# EasyEDA Pro project 外接板20260402.eprj, schematic Schematic1

## Sheets
1 P1: Board Name: Board1; Create Date: 2026-01-12; Page Name: P1; Project Name: 外接板20260402; Schematic Name: Schematic1; Update Date: 2026-05-07; Company: 嘉立创EDA; Page Size: A4; Version: V1.0
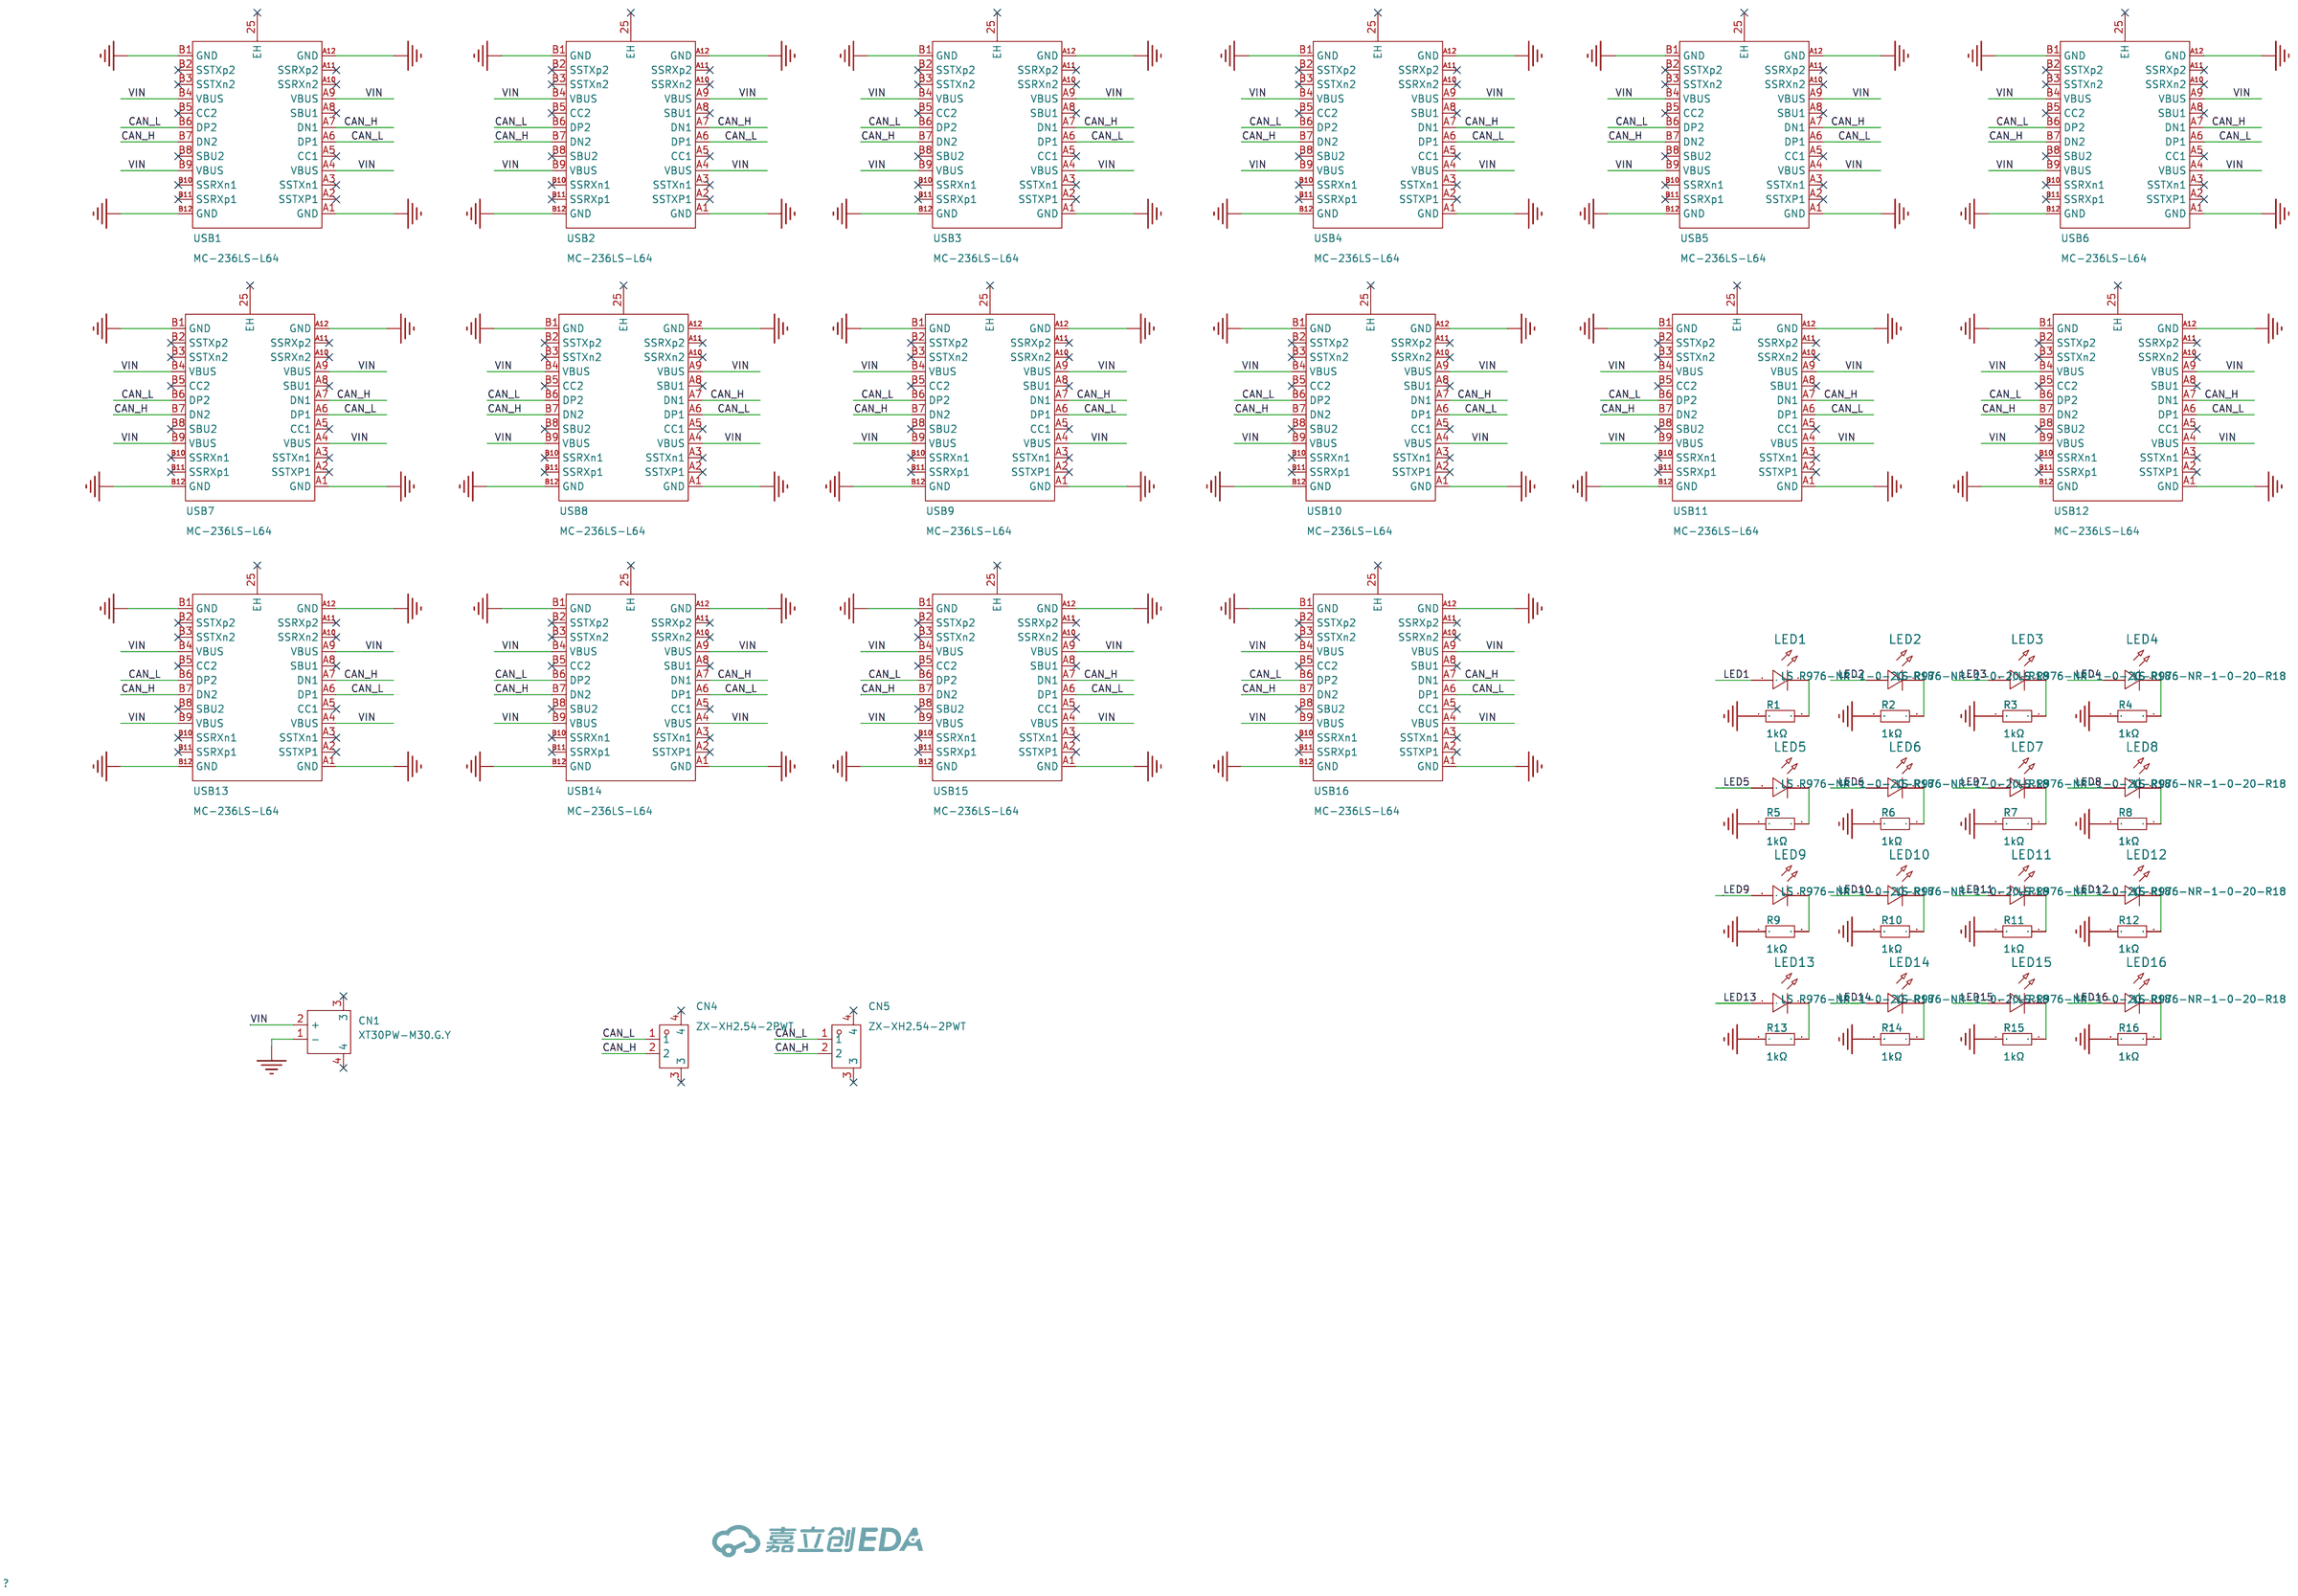
[diagram p0: P1]
2 P2: Create Date: 2026-04-22; Page Name: P2; Update Date: 2026-08-14
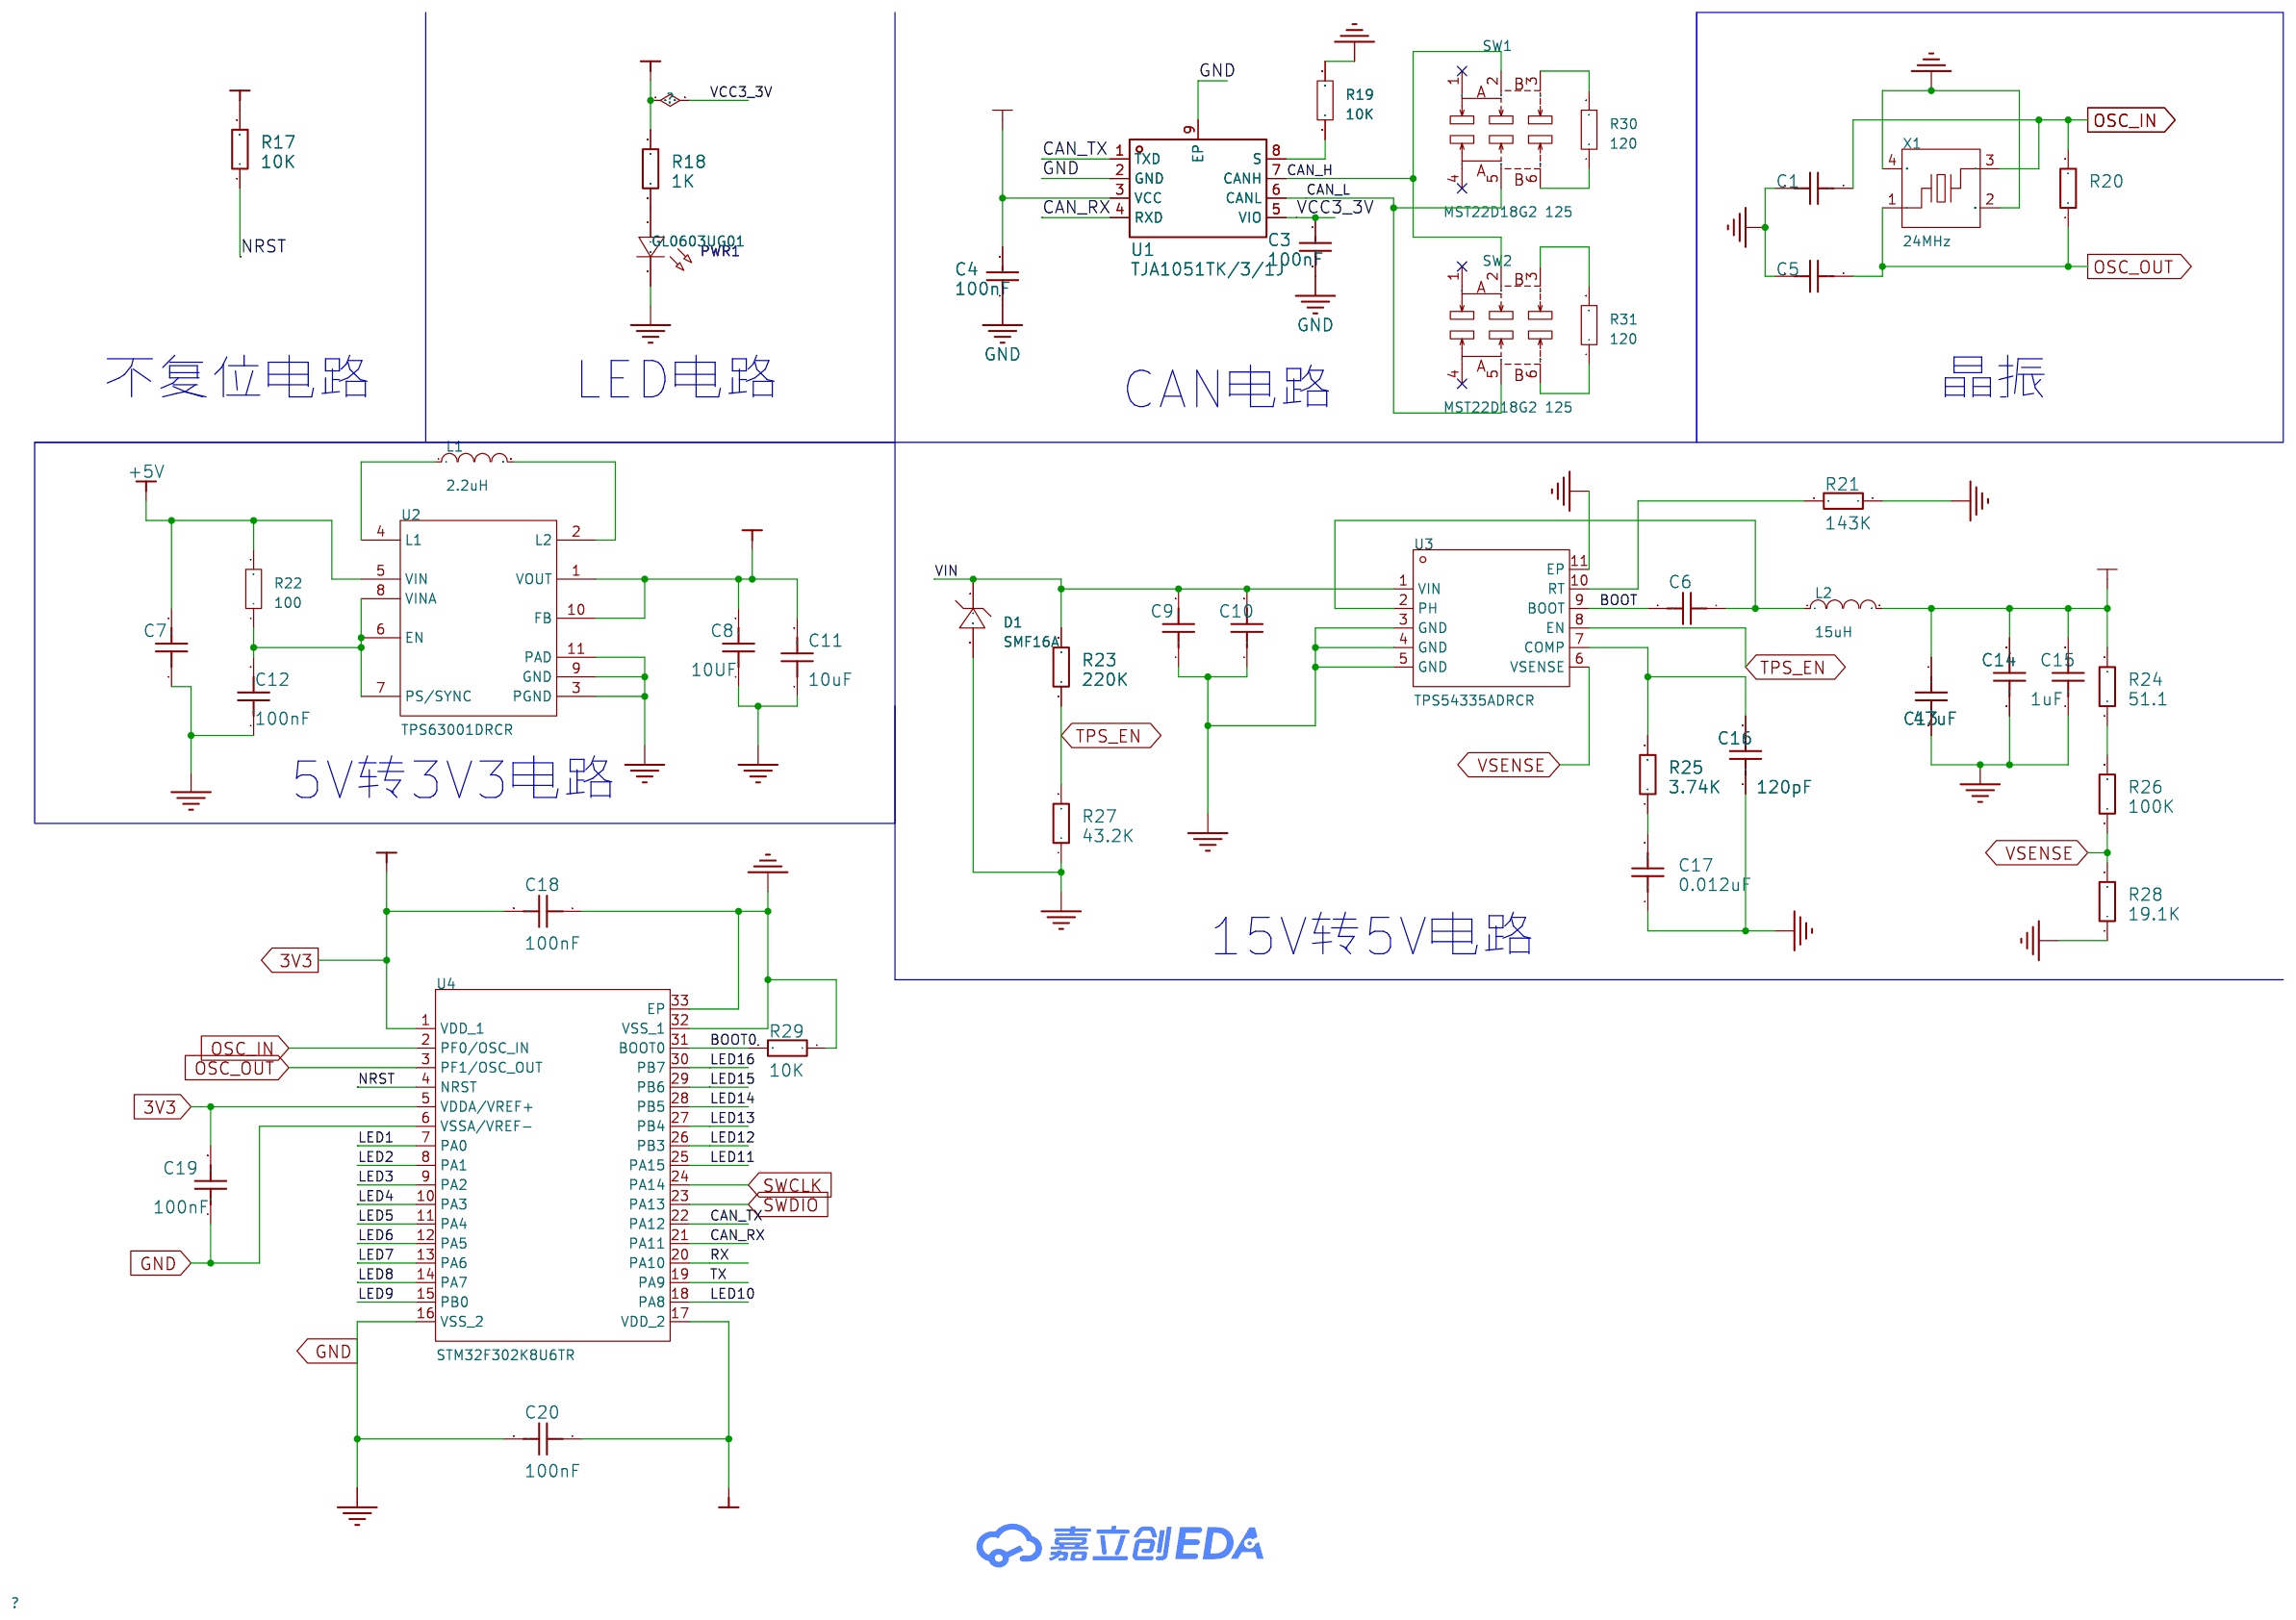
[diagram p1: P2]

## Parts
sheet P1
CN1  XT30PW-M30.G.Y  [CONN-TH_XT30PW-M]
CN4  ZX-XH2.54-2PWT  [CONN-SMD_2P-P2.54_MEGASTAR_ZX-XH2.54-2PWT]
CN5  ZX-XH2.54-2PWT  [CONN-SMD_2P-P2.54_MEGASTAR_ZX-XH2.54-2PWT]
LED1  LS R976-NR-1-0-20-R18  [LED0805-RD_RED]
LED2  LS R976-NR-1-0-20-R18  [LED0805-RD_RED]
LED3  LS R976-NR-1-0-20-R18  [LED0805-RD_RED]
LED4  LS R976-NR-1-0-20-R18  [LED0805-RD_RED]
LED5  LS R976-NR-1-0-20-R18  [LED0805-RD_RED]
LED6  LS R976-NR-1-0-20-R18  [LED0805-RD_RED]
LED7  LS R976-NR-1-0-20-R18  [LED0805-RD_RED]
LED8  LS R976-NR-1-0-20-R18  [LED0805-RD_RED]
LED9  LS R976-NR-1-0-20-R18  [LED0805-RD_RED]
LED10  LS R976-NR-1-0-20-R18  [LED0805-RD_RED]
LED11  LS R976-NR-1-0-20-R18  [LED0805-RD_RED]
LED12  LS R976-NR-1-0-20-R18  [LED0805-RD_RED]
LED13  LS R976-NR-1-0-20-R18  [LED0805-RD_RED]
LED14  LS R976-NR-1-0-20-R18  [LED0805-RD_RED]
LED15  LS R976-NR-1-0-20-R18  [LED0805-RD_RED]
LED16  LS R976-NR-1-0-20-R18  [LED0805-RD_RED]
R1  1kΩ  [R0805]
R2  1kΩ  [R0805]
R3  1kΩ  [R0805]
R4  1kΩ  [R0805]
R5  1kΩ  [R0805]
R6  1kΩ  [R0805]
R7  1kΩ  [R0805]
R8  1kΩ  [R0805]
R9  1kΩ  [R0805]
R10  1kΩ  [R0805]
R11  1kΩ  [R0805]
R12  1kΩ  [R0805]
R13  1kΩ  [R0805]
R14  1kΩ  [R0805]
R15  1kΩ  [R0805]
R16  1kΩ  [R0805]
USB1  MC-236LS-L64  [TYPE-C-USB-SMD_TYPE-C-31-M-06]
USB2  MC-236LS-L64  [TYPE-C-USB-SMD_TYPE-C-31-M-06]
USB3  MC-236LS-L64  [TYPE-C-USB-SMD_TYPE-C-31-M-06]
USB4  MC-236LS-L64  [TYPE-C-USB-SMD_TYPE-C-31-M-06]
USB5  MC-236LS-L64  [TYPE-C-USB-SMD_TYPE-C-31-M-06]
USB6  MC-236LS-L64  [TYPE-C-USB-SMD_TYPE-C-31-M-06]
USB7  MC-236LS-L64  [TYPE-C-USB-SMD_TYPE-C-31-M-06]
USB8  MC-236LS-L64  [TYPE-C-USB-SMD_TYPE-C-31-M-06]
USB9  MC-236LS-L64  [TYPE-C-USB-SMD_TYPE-C-31-M-06]
USB10  MC-236LS-L64  [TYPE-C-USB-SMD_TYPE-C-31-M-06]
USB11  MC-236LS-L64  [TYPE-C-USB-SMD_TYPE-C-31-M-06]
USB12  MC-236LS-L64  [TYPE-C-USB-SMD_TYPE-C-31-M-06]
USB13  MC-236LS-L64  [TYPE-C-USB-SMD_TYPE-C-31-M-06]
USB14  MC-236LS-L64  [TYPE-C-USB-SMD_TYPE-C-31-M-06]
USB15  MC-236LS-L64  [TYPE-C-USB-SMD_TYPE-C-31-M-06]
USB16  MC-236LS-L64  [TYPE-C-USB-SMD_TYPE-C-31-M-06]
sheet P2
C1  8pF  [C0603]
C3  100nF  [C0603]
C4  100nF  [C0603]
C5  8pF  [C0603]
C6  100nF  [C0603]
C7  10uF  [C0603]
C8  10UF  [C0603]
C9  10uF  [C0603]
C10  100nF  [C0603]
C11  10uF  [C0603]
C12  100nF  [C0603]
C13  47uF  [CASE-B_3528-A]
C14  47uF  [C0603]
C15  1uF  [C0603]
C16  120pF  [C0603]
C17  0.012uF  [C0603]
C18  100nF  [C0603]
C19  100nF  [C0603]
C20  100nF  [C0603]
D1  SMF16A  [SOD-123_L2.8-W1.8-LS3.7-RD]
L1  2.2uH  [IND-SMD_L4.0-W4.0_LQH44PN2R2MP0L]
L2  15uH  [IND-SMD_L7.3-W6.8]
PWR1  GL0603UG01  [LED0603-RD]
R17  10K  [R0603]
R18  1K  [R0603]
R19  10K  [R0805]
R20  1MΩ  [R0603]
R21  143K  [R0603]
R22  100  [R0603]
R23  220K  [R0603]
R24  51.1  [R0603]
R25  3.74K  [R0603]
R26  100K  [R0603]
R27  43.2K  [R0603]
R28  19.1K  [R0603]
R29  10K  [R0603]
R30  120  [R0603]
R31  120  [R0603]
SW1  MST22D18G2 125  [SW-SMD_MST22D18G2]
SW2  MST22D18G2 125  [SW-SMD_MST22D18G2]
U1  TJA1051TK/3/1J  [HVSON-8_L3.0-W3.0-P0.65-BL-EP]
U2  TPS63001DRCR  [VSON-10_L3.0-W3.0-P0.50-TL-EP_TPS62410DRCR]
U3  TPS54335ADRCR  [VSON-10_L3.0-W3.0-P0.50-TL-EP]
U4  STM32F302K8U6TR  [UFQFPN-32_L5.0-W5.0-P0.50-TL-EP3.5]
X1  24MHz  [CRYSTAL-SMD_4P-L2.0-W1.6-BL-A]

## Library data of the parts
CN1 = XT30PW-M30.G.Y: 类别:-;类型1:-;; LCSC Part Name: AMASS(艾迈斯)航模插头 卧式弯脚 XT30PW-M公头; Supplier Part: C431092; Manufacturer: AMASS(艾迈斯); JLCPCB Part Class: 扩展库; Datasheet: https://item.szlcsc.com/datasheet/XT30PW-M30.G.Y/426930.html; Supplier: LCSC; Type: 航模插头; RatedVoltage: DC 500V; InterfaceType: 公头; RatedCurrent: 15A; RecommendedWireGauge: 16/18/20AWG; contact resistance: 1.2mΩ; specifications: 2pin
CN4 CN5 = ZX-XH2.54-2PWT: LCSC Part Name: 1x2P 间距:2.5mm 卧贴 系列:XH; Supplier Part: C7429671; Manufacturer: Megastar(兆星); Supplier Footprint: SMD,P=2.5mm,卧贴; JLCPCB Part Class: 扩展库; Datasheet: https://item.szlcsc.com/datasheet/ZX-XH2.54-2PWT/8427588.html; Supplier: LCSC; Pins Structure: 1x2P; Pitch: 2.5mm; Mounting Type: 卧贴; Reference Series: XH; Number of Pins: 2P; Number of Rows: 1; Number of PINs Per Row: 2; Current Rating: 3A; Contact Material: 黄铜; Contact Plating: 锡; Operating Temperature: -25℃~+85℃; Voltage Rating: 250V; Plastic Material: LCP; Supplementary Features: 辅助焊脚; Color: 米色; Z-Height of the Board: 6.2mm; X-Length of Bottom Edge on Board (Spacing Line): 10mm; Y-Width of Bottom Edge on Board: 7.8mm
LED1-LED16 = LS R976-NR-1-0-20-R18: LCSC Part Name: 0805红(雾状); Supplier Part: C2899997; Manufacturer: OSRAM(欧司朗); Supplier Footprint: 0805; JLCPCB Part Class: Extended Part; Datasheet: https://item.szlcsc.com/datasheet/LS%2520R976-NR-1-0-20-R18/3147924.html; Supplier: LCSC; Illumination Color: 红色; Voltage - Forward(Vf): 2V; Forward Current: 20mA; Wavelength - Dominant: 625nm~650nm; Peak Wavelength: 645nm; Lens Color: 雾状白色透镜; Luminous Intensity: 180mcd; Viewing Angle: 160°; Operating Temperature: -30℃~+85℃
R1-R16 = 0805W8F1001T5E: LCSC Part Name: 1kΩ ±1% 125mW 厚膜电阻; Supplier Part: C17513; Manufacturer: UNI-ROYAL(厚声); Supplier Footprint: 0805; JLCPCB Part Class: Basic Part; Datasheet: https://atta.szlcsc.com/upload/public/pdf/source/20200306/C422600_1E6D84923E4A46A82E41ADD87F860B5C.pdf; Supplier: LCSC; Type: 厚膜电阻; Tolerance: ±1%; Power(Watts): 125mW; Overload Voltage (Max): 150V; Temperature Coefficient: ±100ppm/℃; Operating Temperature Range: -55℃~+155℃
USB1-USB16 = MC-236LS-L64: 连接器类型:Type-C;协议标准:USB 3.1;公母:母;安装方式:立贴;触点数量:24P;端口数量:1;额定电流 - 电源:5A;工作温度:-25℃~+85℃;; LCSC Part Name: Type-C 母 立贴; Supplier Part: C3039314; Manufacturer: HANBO(汉博); Supplier Footprint: SMD; JLCPCB Part Class: 扩展库; Datasheet: https://item.szlcsc.com/datasheet/MC-236LS-L64/3592990.html; Supplier: LCSC; Connector Type: Type-C; Protocol Standard: USB 3.1; Gender: 母; Mounting Type: 立贴; Number of Contacts: 24P; Number of Ports: 1; Current Rating-Power: 5A; Voltage Rating: 5V; Connect-Disconnect Life: 1万次; Operating Temperature: -25℃~+85℃
C1 C5 = GRM0335C1H8R0BA01D: LCSC Part Name: ±0.1pF 8pF 50V; Supplier Part: C237417; Manufacturer: muRata(村田); Supplier Footprint: 0201; JLCPCB Part Class: Extended Part; Datasheet: https://atta.szlcsc.com/upload/public/pdf/source/20190418/C237417_572FB960CC3E056ED40D37BCF7887CC2.pdf; Supplier: LCSC; Voltage Rating: 50V; Temperature Coefficient: C0G
C3 C4 C8 C11 C12 C15 C18 C20 = CL03A104KA3NNNC: LCSC Part Name: 100nF(104) ±10% 25V; Supplier Part: C307379; Manufacturer: SAMSUNG(三星); Supplier Footprint: 0201; JLCPCB Part Class: Extended Part; Datasheet: https://atta.szlcsc.com/upload/public/pdf/source/20181009/C307379_F5D0B236C3A55D5E06FA2567D45F0174.pdf; Supplier: LCSC; Temperature Coefficient: X5R; Voltage Rated: 25V; Tolerance: ±10%
C6 C10 = CGA0603X7R104K500JT: LCSC Part Name: 100nF ±10% 50V; Supplier Part: C6119867; Manufacturer: HRE(芯声); Supplier Footprint: 0603; JLCPCB Part Class: Extended Part; Datasheet: https://item.szlcsc.com/datasheet/CGA0603X7R104K500JT/7062573.html; Supplier: LCSC; Tolerance: ±10%; Voltage Rating: 50V; Temperature Coefficient: X7R
C7 = CGA0603X5R106K100JT: LCSC Part Name: 10uF ±10% 10V; Supplier Part: C6119842; Manufacturer: HRE(芯声); Supplier Footprint: 0603; JLCPCB Part Class: Extended Part; Datasheet: https://item.szlcsc.com/datasheet/CGA0603X5R106K100JT/7062548.html; Supplier: LCSC; Tolerance: ±10%; Voltage Rating: 10V; Temperature Coefficient: X5R
C9 = HGC0603R5106M350NTHJ: LCSC Part Name: 10uF ±20% 35V; Supplier Part: C22367827; Manufacturer: Chinocera(华瓷); Supplier Footprint: 0603; JLCPCB Part Class: Extended Part; Datasheet: https://item.szlcsc.com/datasheet/HGC0603R5106M350NTHJ/23841132.html; Supplier: LCSC; Tolerance: ±20%; Voltage Rating: 35V; Temperature Coefficient: X5R
C13 = TAJB476K010RNJ: LCSC Part Name: 47uF ±10% 10V; Supplier Part: C22036; Manufacturer: Kyocera AVX; Supplier Footprint: CASE-B-3528; JLCPCB Part Class: Extended Part; Datasheet: https://atta.szlcsc.com/upload/public/pdf/source/20160107/1457707750344.pdf; Supplier: LCSC; Tolerance: ±10%; Rated Voltage: 10V; Equivalent Series Resistance(ESR): 1Ω@100kHz; Operating Temperature: -55℃~+125℃
C14 = CGA0603X5R105K500JT: LCSC Part Name: 1uF ±10% 50V; Supplier Part: C6119852; Manufacturer: HRE(芯声); Supplier Footprint: 0603; JLCPCB Part Class: Extended Part; Datasheet: https://item.szlcsc.com/datasheet/CGA0603X5R105K500JT/7062558.html; Supplier: LCSC; Tolerance: ±10%; Voltage Rating: 50V; Temperature Coefficient: X5R
C16 = CAP_0603: Supplier Footprint: 0603
C17 = CGA0603X7R123K500JT: LCSC Part Name: 12nF ±10% 50V; Supplier Part: C36911408; Manufacturer: HRE(芯声); Supplier Footprint: 0603; JLCPCB Part Class: Extended Part; Datasheet: https://item.szlcsc.com/datasheet/CGA0603X7R123K500JT/38636296.html; Supplier: LCSC; Tolerance: ±10%; Voltage Rating: 50V; Temperature Coefficient: X7R
C19 = CL05B104KB54PNC: LCSC Part Name: 100nF ±10% 50V; Supplier Part: C307331; Manufacturer: SAMSUNG(三星); Supplier Footprint: 0402; JLCPCB Part Class: Basic Part; Datasheet: https://item.szlcsc.com/datasheet/CL05B104KB54PNC/291005.html; Supplier: LCSC; Tolerance: ±10%; Voltage Rating: 50V; Temperature Coefficient: X7R
D1 = SMF16A: Supplier Part: C266686; Manufacturer: FMS(美丽微); Supplier Footprint: SOD-123; JLCPCB Part Class: 扩展库; Datasheet: https://item.szlcsc.com/datasheet/SMF16A/256777.html; Supplier: LCSC; Reverse Stand-Off Voltage (Vrwm): 16V; Clamping Voltage: 26V; Peak Pulse Current (Ipp): 7.7A; Voltage - Breakdown: 17.8V; Type: TVS
L1 = SMNR4020-2.2UH: LCSC Part Name: 2.2uH ±20% 3.4A; Supplier Part: C135262; Manufacturer: SXN(顺翔诺); Supplier Footprint: SMD,4x4mm; JLCPCB Part Class: Extended Part; Datasheet: https://item.szlcsc.com/datasheet/SMNR4020-2.2UH/146573.html; Supplier: LCSC; Tolerance: ±20%; Current Rating: 3.4A; Current - Saturation(Isat): 3.4A; DC Resistance(DCR): 46mΩ
L2 = MWSA0603S-150MT: LCSC Part Name: 15uH ±20%; Supplier Part: C408452; Manufacturer: Sunlord(顺络); Supplier Footprint: SMD; JLCPCB Part Class: Extended Part; Datasheet: https://atta.szlcsc.com/upload/public/pdf/source/20190729/C408452_7F0A9CFF0AB8A0D8AD496F52F1F29DF7.pdf; Supplier: LCSC; Width: 7mm; Tolerance: ±20%; Length: 6.6mm; Height: 3mm; Rated Current: 3A; DC Resistance (DCR): 113mΩ
PWR1 = GL0603UG01: LCSC Part Name: 0603 翠绿 高亮; Supplier Part: C51933293; Manufacturer: Guiguang light(桂光光电); Supplier Footprint: 0603; JLCPCB Part Class: Extended Part; Datasheet: https://item.szlcsc.com/datasheet/GL0603UG01/54645989.html; Supplier: LCSC; Illumination Color: 翠绿色; Voltage - Forward(Vf): 3.2V; Forward Current: 20mA; Wavelength - Dominant: 510nm~531nm; Diode Configuration: 独立二极管; Lens Color: 无色透明透镜; Luminous Intensity: 358mcd; Viewing Angle: 120°; Mounting Style: 正贴; Operating Temperature: -40℃~+85℃
R17-R19 R21-R31 = Res_0603: Supplier Footprint: 0603
R20 = RC0201FR-071ML: LCSC Part Name: 1MΩ ±1% 50mW; Supplier Part: C295786; Manufacturer: YAGEO(国巨); Supplier Footprint: 0201; JLCPCB Part Class: Extended Part; Datasheet: https://atta.szlcsc.com/upload/public/pdf/source/20180921/C295786_3F2C1EC02A5F9891A7C118DD4066AFE1.pdf; Supplier: LCSC; Type: 厚膜电阻; Tolerance: ±1%; Power(Watts): 50mW; Temperature Coefficient: ±200ppm/℃; Overload Voltage (Max): 25V; Operating Temperature Range: -55℃~+155℃
SW1 SW2 = MST22D18G2 125: LCSC Part Name: MST-22D18G2脚距6.9; Supplier Part: C2906280; Manufacturer: SHOU HAN(首韩); Supplier Footprint: SMD; JLCPCB Part Class: 扩展库; Datasheet: https://item.szlcsc.com/datasheet/MST22D18G2%2520125/3178990.html; Supplier: LCSC; Circuit: 双刀双掷; Termination Style: 鸥翼型; Mounting Type: 立贴; Actuator Color: 黑色; Current Rating: 100mA; Voltage Rating: 12V; Life: 1万次; Operating Temperature: -25℃~+70℃
U1 = TJA1051TK/3/1J: Supplier Part: C2875699; Manufacturer: NXP(恩智浦); Supplier Footprint: VDFN-8; JLCPCB Part Class: ExtendedPart; Datasheet: https://atta.szlcsc.com/upload/public/pdf/source/20210128/C2671135_A82E49CDEFC20634F2534E8F261E286A.pdf; Supplier: LCSC; Check: true
U2 = TPS63001DRCR: LCSC Part Name: 高效率单电感升降压转换器; Supplier Part: C28060; Manufacturer: TI(德州仪器); Supplier Footprint: VSON-10-EP(3x3); JLCPCB Part Class: 扩展库; Datasheet: https://www.ti.com/cn/lit/gpn/tps63001; Supplier: LCSC; Function: 升降压型; Output Type: 固定; Voltage - Supply: 1.8V~5.5V; Output Voltage: 3.3V; Frequency - Switching: 1.5MHz; Operating Temperature: -40℃~+85℃@(TA); Synchronous Rectifier: 是; Number of Outputs: 1; Topology: 降压-升压式; Switch tube (built-in/external): 内置
U3 = TPS54335ADRCR: LCSC Part Name: 4.5V至28V输入，3A输出同步降压DC-DC转换器; Supplier Part: C473400; Manufacturer: TI(德州仪器); Supplier Footprint: VSON-10-EP(3x3); JLCPCB Part Class: 扩展库; Datasheet: https://www.ti.com/cn/lit/gpn/tps54335a; Supplier: LCSC; Function: 降压型; Voltage - Supply: 4.5V~28V; Output Voltage: 800mV~24V; Output Current: 3A; Frequency - Switching: 1.5MHz; Operating Temperature: -40℃~+150℃@(TJ); Synchronous Rectifier: 是; Number of Outputs: 1; Topology: 降压式; Quiescent Current: 310uA; Switch tube (built-in/external): 内置; Output Type: 可调
U4 = STM32F302K8U6TR: LCSC Part Name: 带DSP和FPU的主流混合信号ARM Cortex-M4 MCU，具有64 KB Flash、72 MHz CPU、5 MSPS 12位ADC、比较器和运算放大器; Supplier Part: C2971069; Manufacturer: ST(意法半导体); Supplier Footprint: UFQFPN-32(5x5); JLCPCB Part Class: 扩展库; Datasheet: https://item.szlcsc.com/datasheet/STM32F302K8U6TR/3363533.html; Supplier: LCSC; CPU Core: ARM-M4; CPU Maximum Speed: 72MHz; Program Storage Size: 64KB; Number of I/O: 24; ADC (Bit): 12bit; DAC (Bit): 12bit; Voltage - Supply: 2V~3.6V
X1 = XL7EL89CKI-111YLC-24M: LCSC Part Name: YSX211SL 24MHZ 4P 2016 8PF ±10PPM -40~85℃ (±20PPM); Supplier Part: C2965580; Manufacturer: YXC(扬兴晶振); Supplier Footprint: SMD2016-4P; JLCPCB Part Class: 扩展库; Datasheet: https://item.szlcsc.com/datasheet/XL7EL89CKI-111YLC-24M/3357716.html; Supplier: LCSC; Type: 贴片晶振; Normal temperature Frequency Tolerance: ±10ppm; Load Capacitance: 8pF; Frequency Stability: ±20ppm; Operating Temperature: -40℃~+85℃

## Nets
3V3: C3.2 C8.2 C11.2 C18.2 C19.2 C20.1 R17.2 R18.2 U1.5(VIO) U2.1(VOUT) U2.10(FB) U4.1(VDD) U4.5(VDDA/VREF+) U4.17(VDD_2)
+5V: C4.2 C7.2 C13.1 C14.2 C15.2 L2.2 R22.2 R24.2 U1.3(VCC) U2.5(VIN)
GND: C1.1 C3.1 C4.1 C5.1 C7.1 C8.1 C9.1 C10.1 C11.1 C12.1 C13.2 C14.1 C15.1 C16.1 C17.1 C18.1 C19.1 C20.2 CN1.1(-) D1.2 PWR1.1(C) R1.2 R2.2 R3.2 R4.2 R5.2 R6.2 R7.2 R8.2 R9.2 R10.2 R11.2 R12.2 R13.2 R14.2 R15.2 R16.2 R19.2 R21.1 R27.1 R28.1 R29.1 U1.2(GND) U1.9(EP) U2.3(PGND) U2.9(GND) U2.11(PAD) U3.3(GND) U3.4(GND) U3.5(GND) U3.11(EP) U4.6(VSSA/VREF-) U4.16(VSS_2) U4.32(VSS_1) U4.33(EP) USB1.A1(GND) USB1.A12(GND) USB1.B1(GND) USB1.B12(GND) USB2.A1(GND) USB2.A12(GND) USB2.B1(GND) USB2.B12(GND) USB3.A1(GND) USB3.A12(GND) USB3.B1(GND) USB3.B12(GND) USB4.A1(GND) USB4.A12(GND) USB4.B1(GND) USB4.B12(GND) USB5.A1(GND) USB5.A12(GND) USB5.B1(GND) USB5.B12(GND) USB6.A1(GND) USB6.A12(GND) USB6.B1(GND) USB6.B12(GND) USB7.A1(GND) USB7.A12(GND) USB7.B1(GND) USB7.B12(GND) USB8.A1(GND) USB8.A12(GND) USB8.B1(GND) USB8.B12(GND) USB9.A1(GND) USB9.A12(GND) USB9.B1(GND) USB9.B12(GND) USB10.A1(GND) USB10.A12(GND) USB10.B1(GND) USB10.B12(GND) USB11.A1(GND) USB11.A12(GND) USB11.B1(GND) USB11.B12(GND) USB12.A1(GND) USB12.A12(GND) USB12.B1(GND) USB12.B12(GND) USB13.A1(GND) USB13.A12(GND) USB13.B1(GND) USB13.B12(GND) USB14.A1(GND) USB14.A12(GND) USB14.B1(GND) USB14.B12(GND) USB15.A1(GND) USB15.A12(GND) USB15.B1(GND) USB15.B12(GND) USB16.A1(GND) USB16.A12(GND) USB16.B1(GND) USB16.B12(GND) X1.2(GND) X1.4(GND)
VIN: C9.2 C10.2 CN1.2(+) D1.1 R23.2 U3.1(VIN) USB1.A4(VBUS) USB1.A9(VBUS) USB1.B4(VBUS) USB1.B9(VBUS) USB2.A4(VBUS) USB2.A9(VBUS) USB2.B4(VBUS) USB2.B9(VBUS) USB3.A4(VBUS) USB3.A9(VBUS) USB3.B4(VBUS) USB3.B9(VBUS) USB4.A4(VBUS) USB4.A9(VBUS) USB4.B4(VBUS) USB4.B9(VBUS) USB5.A4(VBUS) USB5.A9(VBUS) USB5.B4(VBUS) USB5.B9(VBUS) USB6.A4(VBUS) USB6.A9(VBUS) USB6.B4(VBUS) USB6.B9(VBUS) USB7.A4(VBUS) USB7.A9(VBUS) USB7.B4(VBUS) USB7.B9(VBUS) USB8.A4(VBUS) USB8.A9(VBUS) USB8.B4(VBUS) USB8.B9(VBUS) USB9.A4(VBUS) USB9.A9(VBUS) USB9.B4(VBUS) USB9.B9(VBUS) USB10.A4(VBUS) USB10.A9(VBUS) USB10.B4(VBUS) USB10.B9(VBUS) USB11.A4(VBUS) USB11.A9(VBUS) USB11.B4(VBUS) USB11.B9(VBUS) USB12.A4(VBUS) USB12.A9(VBUS) USB12.B4(VBUS) USB12.B9(VBUS) USB13.A4(VBUS) USB13.A9(VBUS) USB13.B4(VBUS) USB13.B9(VBUS) USB14.A4(VBUS) USB14.A9(VBUS) USB14.B4(VBUS) USB14.B9(VBUS) USB15.A4(VBUS) USB15.A9(VBUS) USB15.B4(VBUS) USB15.B9(VBUS) USB16.A4(VBUS) USB16.A9(VBUS) USB16.B4(VBUS) USB16.B9(VBUS)
BOOT: C6.2 U3.9(BOOT)
BOOT0: R29.2 U4.31(BOOT0)
CAN_H: CN4.2 CN5.2 SW1.2 SW2.2 U1.7(CANH) USB1.A7(DN1) USB1.B7(DN2) USB2.A7(DN1) USB2.B7(DN2) USB3.A7(DN1) USB3.B7(DN2) USB4.A7(DN1) USB4.B7(DN2) USB5.A7(DN1) USB5.B7(DN2) USB6.A7(DN1) USB6.B7(DN2) USB7.A7(DN1) USB7.B7(DN2) USB8.A7(DN1) USB8.B7(DN2) USB9.A7(DN1) USB9.B7(DN2) USB10.A7(DN1) USB10.B7(DN2) USB11.A7(DN1) USB11.B7(DN2) USB12.A7(DN1) USB12.B7(DN2) USB13.A7(DN1) USB13.B7(DN2) USB14.A7(DN1) USB14.B7(DN2) USB15.A7(DN1) USB15.B7(DN2) USB16.A7(DN1) USB16.B7(DN2)
CAN_L: CN4.1 CN5.1 SW1.5 SW2.5 U1.6(CANL) USB1.A6(DP1) USB1.B6(DP2) USB2.A6(DP1) USB2.B6(DP2) USB3.A6(DP1) USB3.B6(DP2) USB4.A6(DP1) USB4.B6(DP2) USB5.A6(DP1) USB5.B6(DP2) USB6.A6(DP1) USB6.B6(DP2) USB7.A6(DP1) USB7.B6(DP2) USB8.A6(DP1) USB8.B6(DP2) USB9.A6(DP1) USB9.B6(DP2) USB10.A6(DP1) USB10.B6(DP2) USB11.A6(DP1) USB11.B6(DP2) USB12.A6(DP1) USB12.B6(DP2) USB13.A6(DP1) USB13.B6(DP2) USB14.A6(DP1) USB14.B6(DP2) USB15.A6(DP1) USB15.B6(DP2) USB16.A6(DP1) USB16.B6(DP2)
CAN_RX: U1.4(RXD) U4.21(PA11)
CAN_TX: U1.1(TXD) U4.22(PA12)
LED1: LED1.2(A) U4.7(PA0)
LED2: LED2.2(A) U4.8(PA1)
LED3: LED3.2(A) U4.9(PA2)
LED4: LED4.2(A) U4.10(PA3)
LED5: LED5.2(A) U4.11(PA4)
LED6: LED6.2(A) U4.12(PA5)
LED7: LED7.2(A) U4.13(PA6)
LED8: LED8.2(A) U4.14(PA7)
LED9: LED9.2(A) U4.15(PB0)
LED10: LED10.2(A) U4.18(PA8)
LED11: LED11.2(A) U4.25(PA15)
LED12: LED12.2(A) U4.26(PB3)
LED13: LED13.2(A) U4.27(PB4)
LED14: LED14.2(A) U4.28(PB5)
LED15: LED15.2(A) U4.29(PB6)
LED16: LED16.2(A) U4.30(PB7)
NRST: R17.1 U4.4(NRST)
OSC_IN: C1.2 R20.2 U4.2(PF0/OSC_IN) X1.3
OSC_OUT: C5.2 R20.1 U4.3(PF1/OSC_OUT) X1.1
RX: U4.20(PA10)
SWCLK: U4.24(PA14)
SWDIO: U4.23(PA13)
TPS_EN: R23.1 R27.2 U3.8(EN)
TX: U4.19(PA9)
VSENSE: R26.1 R28.2 U3.6(VSENSE)
$1N30340: LED1.1(C) R1.1
$1N30433: LED2.1(C) R2.1
$1N30567: LED3.1(C) R3.1
$1N30574: LED4.1(C) R4.1
$1N30835: LED5.1(C) R5.1
$1N30842: LED6.1(C) R6.1
$1N30849: LED7.1(C) R7.1
$1N30856: LED8.1(C) R8.1
$1N31119: LED9.1(C) R9.1
$1N31126: LED10.1(C) R10.1
$1N31133: LED11.1(C) R11.1
$1N31140: LED12.1(C) R12.1
$1N33758: LED15.1(C) R15.1
$1N33759: LED14.1(C) R14.1
$1N33762: LED16.1(C) R16.1
$1N33769: LED13.1(C) R13.1
$2N13343: PWR1.2(A) R18.1
$2N16572: R21.2 U3.10(RT)
$2N16689: C6.1 L2.1 U3.2(PH)
$2N16831: C17.2 R25.1
$2N16866: C16.2 R25.2 U3.7(COMP)
$2N17126: R24.1 R26.2
$2N18646: L1.1 U2.4(L1)
$2N18651: L1.2 U2.2(L2)
$2N18674: C12.2 R22.1 U2.6(EN) U2.7(PS/SYNC) U2.8(VINA)
$2N27785: R19.1 U1.8(S)
$2N36064: R30.2 SW1.3
$2N36070: R30.1 SW1.6
$2N36103: R31.2 SW2.3
$2N36110: R31.1 SW2.6

Not connected (* = marked no-connect by the designer): CN1 3* 4*; CN4 3* 4*; CN5 3* 4*; SW1 1* 4*; SW2 1* 4*; USB1 25(EH)* A2(SSTXP1)* A3(SSTXn1)* A5(CC1)* A8(SBU1)* A10(SSRXn2)* A11(SSRXp2)* B2(SSTXp2)* B3(SSTXn2)* B5(CC2)* B8(SBU2)* B10(SSRXn1)* B11(SSRXp1)*; USB2 25(EH)* A2(SSTXP1)* A3(SSTXn1)* A5(CC1)* A8(SBU1)* A10(SSRXn2)* A11(SSRXp2)* B2(SSTXp2)* B3(SSTXn2)* B5(CC2)* B8(SBU2)* B10(SSRXn1)* B11(SSRXp1)*; USB3 25(EH)* A2(SSTXP1)* A3(SSTXn1)* A5(CC1)* A8(SBU1)* A10(SSRXn2)* A11(SSRXp2)* B2(SSTXp2)* B3(SSTXn2)* B5(CC2)* B8(SBU2)* B10(SSRXn1)* B11(SSRXp1)*; USB4 25(EH)* A2(SSTXP1)* A3(SSTXn1)* A5(CC1)* A8(SBU1)* A10(SSRXn2)* A11(SSRXp2)* B2(SSTXp2)* B3(SSTXn2)* B5(CC2)* B8(SBU2)* B10(SSRXn1)* B11(SSRXp1)*; USB5 25(EH)* A2(SSTXP1)* A3(SSTXn1)* A5(CC1)* A8(SBU1)* A10(SSRXn2)* A11(SSRXp2)* B2(SSTXp2)* B3(SSTXn2)* B5(CC2)* B8(SBU2)* B10(SSRXn1)* B11(SSRXp1)*; USB6 25(EH)* A2(SSTXP1)* A3(SSTXn1)* A5(CC1)* A8(SBU1)* A10(SSRXn2)* A11(SSRXp2)* B2(SSTXp2)* B3(SSTXn2)* B5(CC2)* B8(SBU2)* B10(SSRXn1)* B11(SSRXp1)*; USB7 25(EH)* A2(SSTXP1)* A3(SSTXn1)* A5(CC1)* A8(SBU1)* A10(SSRXn2)* A11(SSRXp2)* B2(SSTXp2)* B3(SSTXn2)* B5(CC2)* B8(SBU2)* B10(SSRXn1)* B11(SSRXp1)*; USB8 25(EH)* A2(SSTXP1)* A3(SSTXn1)* A5(CC1)* A8(SBU1)* A10(SSRXn2)* A11(SSRXp2)* B2(SSTXp2)* B3(SSTXn2)* B5(CC2)* B8(SBU2)* B10(SSRXn1)* B11(SSRXp1)*; USB9 25(EH)* A2(SSTXP1)* A3(SSTXn1)* A5(CC1)* A8(SBU1)* A10(SSRXn2)* A11(SSRXp2)* B2(SSTXp2)* B3(SSTXn2)* B5(CC2)* B8(SBU2)* B10(SSRXn1)* B11(SSRXp1)*; USB10 25(EH)* A2(SSTXP1)* A3(SSTXn1)* A5(CC1)* A8(SBU1)* A10(SSRXn2)* A11(SSRXp2)* B2(SSTXp2)* B3(SSTXn2)* B5(CC2)* B8(SBU2)* B10(SSRXn1)* B11(SSRXp1)*; USB11 25(EH)* A2(SSTXP1)* A3(SSTXn1)* A5(CC1)* A8(SBU1)* A10(SSRXn2)* A11(SSRXp2)* B2(SSTXp2)* B3(SSTXn2)* B5(CC2)* B8(SBU2)* B10(SSRXn1)* B11(SSRXp1)*; USB12 25(EH)* A2(SSTXP1)* A3(SSTXn1)* A5(CC1)* A8(SBU1)* A10(SSRXn2)* A11(SSRXp2)* B2(SSTXp2)* B3(SSTXn2)* B5(CC2)* B8(SBU2)* B10(SSRXn1)* B11(SSRXp1)*; USB13 25(EH)* A2(SSTXP1)* A3(SSTXn1)* A5(CC1)* A8(SBU1)* A10(SSRXn2)* A11(SSRXp2)* B2(SSTXp2)* B3(SSTXn2)* B5(CC2)* B8(SBU2)* B10(SSRXn1)* B11(SSRXp1)*; USB14 25(EH)* A2(SSTXP1)* A3(SSTXn1)* A5(CC1)* A8(SBU1)* A10(SSRXn2)* A11(SSRXp2)* B2(SSTXp2)* B3(SSTXn2)* B5(CC2)* B8(SBU2)* B10(SSRXn1)* B11(SSRXp1)*; USB15 25(EH)* A2(SSTXP1)* A3(SSTXn1)* A5(CC1)* A8(SBU1)* A10(SSRXn2)* A11(SSRXp2)* B2(SSTXp2)* B3(SSTXn2)* B5(CC2)* B8(SBU2)* B10(SSRXn1)* B11(SSRXp1)*; USB16 25(EH)* A2(SSTXP1)* A3(SSTXn1)* A5(CC1)* A8(SBU1)* A10(SSRXn2)* A11(SSRXp2)* B2(SSTXp2)* B3(SSTXn2)* B5(CC2)* B8(SBU2)* B10(SSRXn1)* B11(SSRXp1)*

## Notes on the sheets
sheet 2
- 不复位电路
- LED电路
- CAN电路
- 晶振
- 5V转3V3电路
- 15V转5V电路
